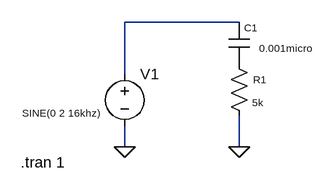
[diagram p0: schematic highpass1.asc]
highpass1.asc, the LTspice schematic file:
Version 4
SHEET 1 880 680
WIRE 304 64 128 64
WIRE 128 144 128 64
WIRE 128 256 128 224
WIRE 304 256 304 208
FLAG 128 256 0
FLAG 304 256 0
SYMBOL voltage 128 128 R0
WINDOW 3 -158 76 Left 1
WINDOW 123 0 0 Left 0
WINDOW 39 0 0 Left 0
SYMATTR InstName V1
SYMATTR Value SINE(0 2 16khz)
SYMBOL cap 288 64 R0
WINDOW 0 24 8 Left 1
WINDOW 3 127 40 Right 1
SYMATTR InstName C1
SYMATTR Value 0.001micro
SYMBOL res 288 112 R0
WINDOW 0 58 40 Right 1
WINDOW 3 36 76 Left 1
SYMATTR InstName R1
SYMATTR Value 5k
TEXT -32 280 Left 2 !.tran 1

The netlist it stands for:
* highpass1.asc
V1 N001 0 SINE(0 2 16khz)
C1 N001 P001 0.001micro
R1 P001 0 5k
.tran 1
.backanno
.end